# EAGLE design Design (EAGLE 9.6.2)
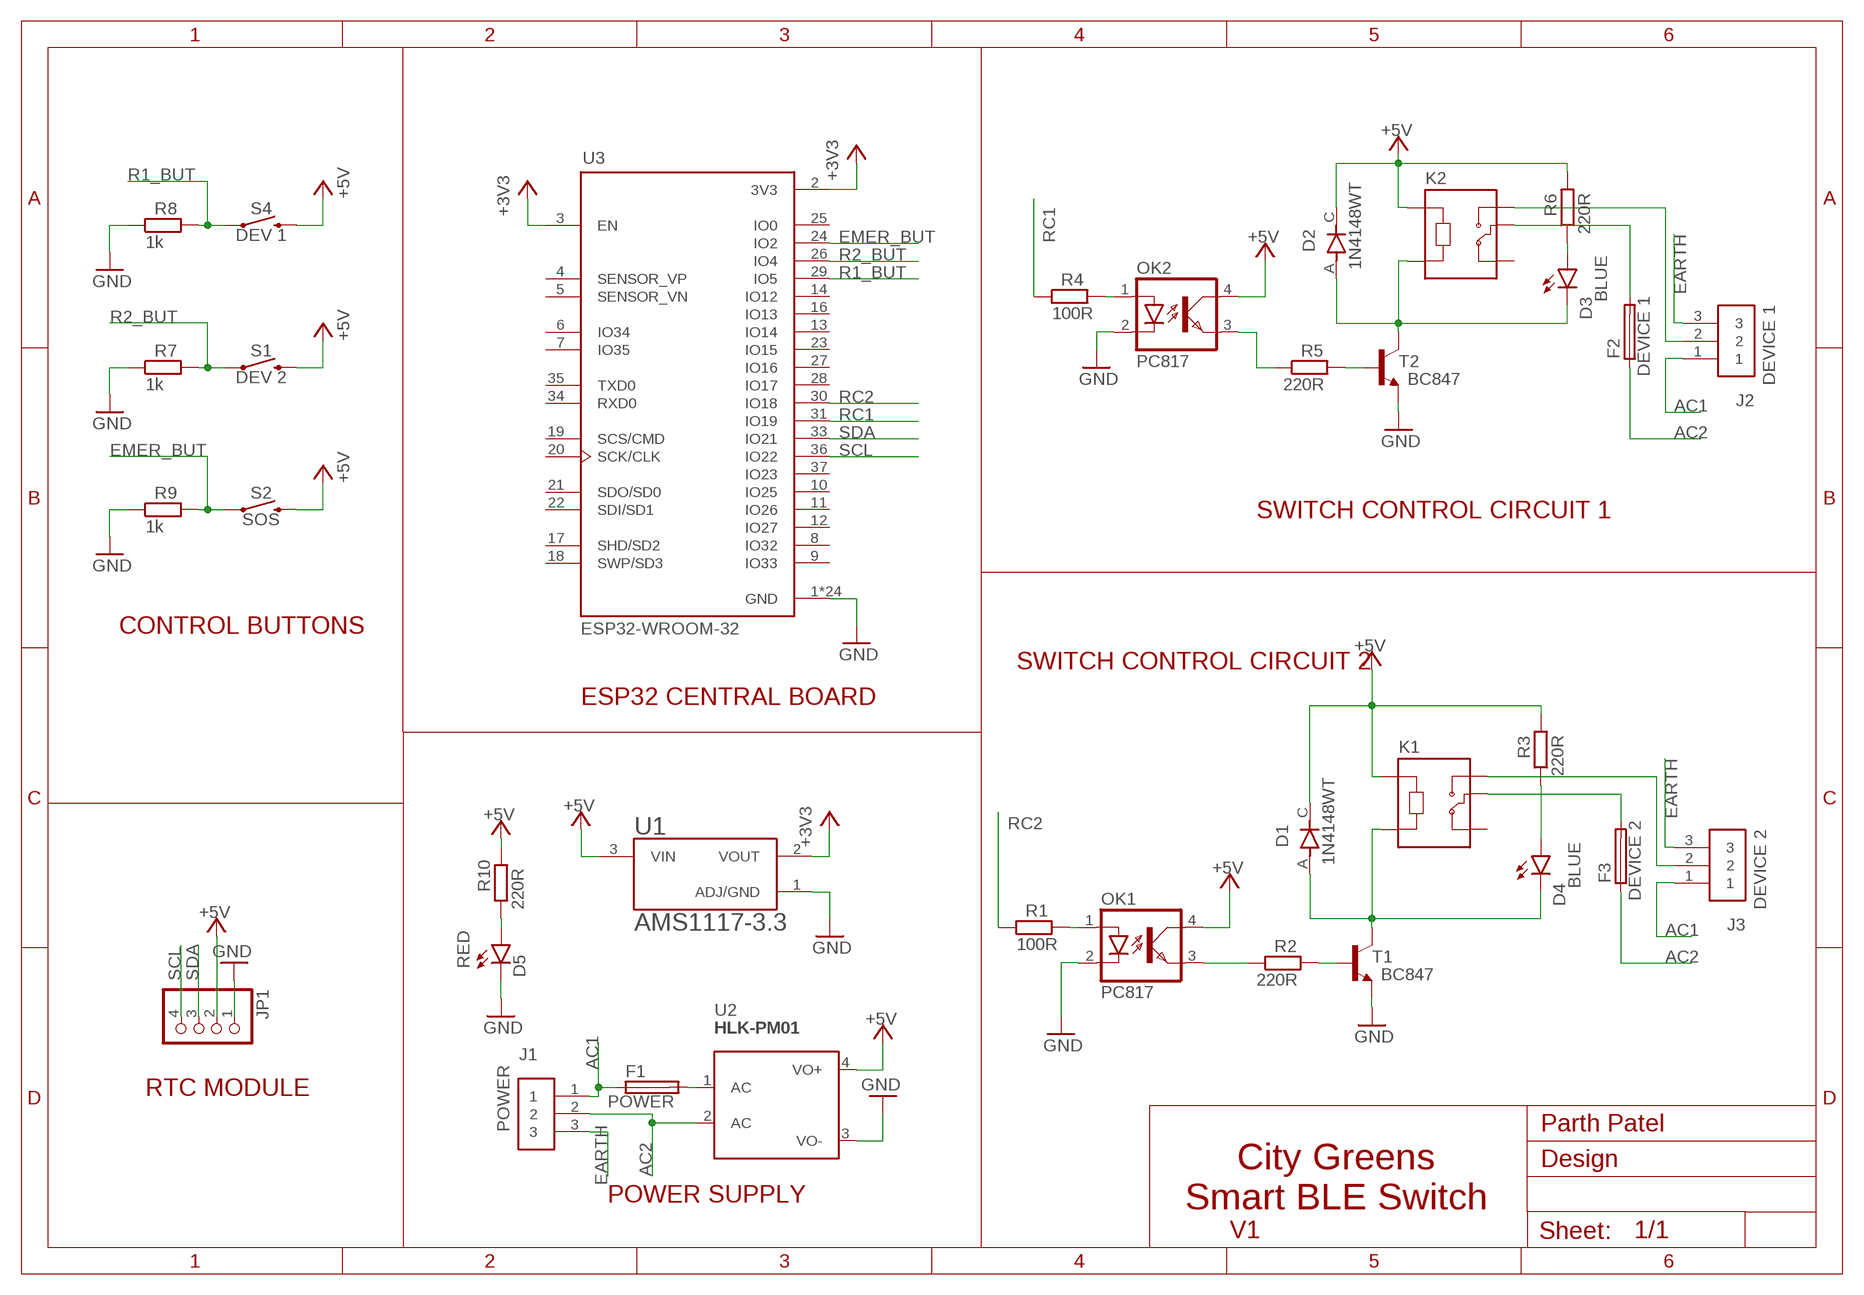
[diagram p0: schematic, sheet 1]

## Parts
D1  1N4148WT  [SODFL1608X70N]
D2  1N4148WT  [SODFL1608X70N]
D3  BLUE  LEDCHIP-LED0603  [CHIP-LED0603]
D4  BLUE  LEDCHIP-LED0603  [CHIP-LED0603]
D5  RED  LEDCHIP-LED0603  [CHIP-LED0603]
F1  POWER  TE5  [TE5]
F2  DEVICE 1  TE5  [TE5]
F3  DEVICE 2  TE5  [TE5]
J1  POWER  691311400103  [TERMINALBLOCK_PLUGGABLE-3-7.62MM]
J2  DEVICE 1  691311400103  [TERMINALBLOCK_PLUGGABLE-3-7.62MM]
J3  DEVICE 2  691311400103  [TERMINALBLOCK_PLUGGABLE-3-7.62MM]
JP1  PINHD-1X4  [1X04]
K1  SRD-05VDC-SL-C  [RELAY_SRD-05VDC-SL-C]
K2  SRD-05VDC-SL-C  [RELAY_SRD-05VDC-SL-C]
OK1  PC817  [DIL04]
OK2  PC817  [DIL04]
R1  100R  R-EU_R0805  [R0805]
R2  220R  R-EU_R0805  [R0805]
R3  220R  R-EU_R0805  [R0805]
R4  100R  R-EU_R0805  [R0805]
R5  220R  R-EU_R0805  [R0805]
R6  220R  R-EU_R0805  [R0805]
R7  1k  R-EU_R0805  [R0805]
R8  1k  R-EU_R0805  [R0805]
R9  1k  R-EU_R0805  [R0805]
R10  220R  R-EU_R0805  [R0805]
S1  DEV 2  MOMENTARY-SWITCH-SPST-SMD-4.5MM  [TACTILE_SWITCH_SMD_4.5MM]
S2  SOS  MOMENTARY-SWITCH-SPST-SMD-4.5MM  [TACTILE_SWITCH_SMD_4.5MM]
S4  DEV 1  MOMENTARY-SWITCH-SPST-SMD-4.5MM  [TACTILE_SWITCH_SMD_4.5MM]
T1  BC847  [SOT23]
T2  BC847  [SOT23]
U1  AMS1117-3.3  [SOT229P700X180-4N]
U2  HLK-PM01  [HLK-PM01]
U3  ESP32-WROOM-32  [MODULE_ESP32-WROOM-32]

## Nets
+3V3: U1.2(VOUT) U3.2(3V3) U3.3(EN)
+5V: D1.C D2.C JP1.2 K1.A1 K2.A1 OK1.4(COL) OK2.4(COL) R3.2 R6.2 R10.2 S1.1 S1.4 S2.1 S2.4 S4.1 S4.4 U1.3(VIN) U2.4(VO+)
AC1: F1.1 J1.1 J2.1 J3.1
AC2: F2.1 F3.1 J1.2 U2.2(AC)
EARTH: J1.3 J2.3 J3.3
EMER_BUT: R9.2 S2.2 S2.3 U3.24(IO2)
GND: D5.C JP1.1 OK1.2(C) OK2.2(C) R7.1 R8.1 R9.1 T1.2(E) T2.2(E) U1.1(ADJ/GND) U2.3(VO-) U3.1(GND) U3.15(GND) U3.38(GND) U3.39_1(GND) U3.39_2(GND) U3.39_3(GND) U3.39_4(GND) U3.39_5(GND) U3.39_6(GND) U3.39_7(GND) U3.39_8(GND) U3.39_9(GND) U3.39_10(GND) U3.39_11(GND) U3.39_12(GND) U3.39_13(GND) U3.39_14(GND) U3.39_15(GND) U3.39_16(GND) U3.39_17(GND) U3.39_18(GND) U3.39_19(GND) U3.39_20(GND) U3.39_21(GND)
N$1: F1.2 U2.1(AC)
N$2: OK1.3(EMIT) R2.1
N$3: OK1.1(A) R1.2
N$4: R2.2 T1.1(B)
N$6: D1.A D4.C K1.A2 T1.3(C)
N$7: D4.A R3.1
N$8: J3.2 K1.NO
N$9: OK2.1(A) R4.2
N$10: OK2.3(EMIT) R5.1
N$11: R5.2 T2.1(B)
N$12: D2.A D3.C K2.A2 T2.3(C)
N$13: D3.A R6.1
N$14: F2.2 K2.COM
N$15: J2.2 K2.NO
N$16: F3.2 K1.COM
N$17: D5.A R10.1
R1_BUT: R8.2 S4.2 S4.3 U3.29(IO5)
R2_BUT: R7.2 S1.2 S1.3 U3.26(IO4)
RC1: R4.1 U3.31(IO19)
RC2: R1.1 U3.30(IO18)
SCL: JP1.4 U3.36(IO22)
SDA: JP1.3 U3.33(IO21)
Unconnected: K1.NC K2.NC U3.4(SENSOR_VP) U3.5(SENSOR_VN) U3.6(IO34) U3.7(IO35) U3.8(IO32) U3.9(IO33) U3.10(IO25) U3.11(IO26) U3.12(IO27) U3.13(IO14) U3.14(IO12) U3.16(IO13) U3.17(SHD/SD2) U3.18(SWP/SD3) U3.19(SCS/CMD) U3.20(SCK/CLK) U3.21(SDO/SD0) U3.22(SDI/SD1) U3.23(IO15) U3.25(IO0) U3.27(IO16) U3.28(IO17) U3.34(RXD0) U3.35(TXD0) U3.37(IO23)

## Notes on the sheet
- SWITCH CONTROL CIRCUIT 1
- CONTROL BUTTONS
- SWITCH CONTROL CIRCUIT 2
- ESP32 CENTRAL BOARD
- RTC MODULE
- Parth Patel
- City Greens
  Smart BLE Switch
- POWER SUPPLY
- V1

## Library data of the parts
D1 = 1N4148WT:1N4148WT: Diode Switching 100V 0.125A 2-Pin SOD-523 Check availability <https://pricing.snapeda.com/parts/1N4148WT/ON%20Semiconductor/view-part?ref=eda>; AVAILABILITY: In Stock; DESCRIPTION: 1N4148WT Series 75 V 300 mA High Conductance Fast Switching Diode - SOD-523F; MF: ON Semiconductor; MP: 1N4148WT; PACKAGE: SOD-523-2 ON Semiconductor; PRICE: None; PURCHASE-URL: https://pricing.snapeda.com/search/part/1N4148WT/?ref=eda
D2 = 1N4148WT:1N4148WT: Diode Switching 100V 0.125A 2-Pin SOD-523 Check availability <https://pricing.snapeda.com/parts/1N4148WT/ON%20Semiconductor/view-part?ref=eda>; AVAILABILITY: In Stock; DESCRIPTION: 1N4148WT Series 75 V 300 mA High Conductance Fast Switching Diode - SOD-523F; MF: ON Semiconductor; MP: 1N4148WT; PACKAGE: SOD-523-2 ON Semiconductor; PRICE: None; PURCHASE-URL: https://pricing.snapeda.com/search/part/1N4148WT/?ref=eda; SPICEPREFIX: D
D3-D5 = led:LED: LED OSRAM: - CHIPLED LG R971, LG N971, LY N971, LG Q971, LY Q971, LO R971, LY R971 LH N974, LH R974 LS Q976, LO Q976, LY Q976 LO Q996 - Hyper CHIPLED LW Q18S LB Q993, LB Q99A, LB R99A - SideLED LS A670, LO A670, LY A670, LG A670, LP A670 LB A673, LV A673, LT A673, LW A673 LH A674 LY A675 LS A676, LA A676, LO A676, LY A676, LW A676 LS A679, LY A679, LG A679 - Hyper Micro SIDELED® LS Y876, LA Y876, LO Y876, LY Y876 LT Y87S - SmartLED LW L88C, LW L88S LB L89C, LB L89S, LG L890 LS L89K, LO L89K, LY L89K LS L896, LA L896, LO L896, LY L896 - TOPLED LS T670, LO T670, LY T670, LG T670, LP T670 LSG T670, LSP T670, LSY T670, LOP T670, LYG T670 LG T671, LOG T671, LSG T671 LB T673, LV T673, LT T673, LW T673 LH T674 LS T676, LA T676, LO T676, LY T676, LB T676, LH T676, LSB T676, LW T676 LB T67C, LV T67C, LT T67C, LS T67K, LO T67K, LY T67K, LW E67C LS E67B, LA E67B, LO E67B, LY E67B, LB E67C, LV E67C, LT E67C LW T67C LS T679, LY T679, LG T679 LS T770, LO T770, LY T770, LG T770, LP T770 LB T773, LV T773, LT T773, LW T773 LH T774 LS E675, LA E675, LY E675, LS T675 LS T776, LA T776, LO T776, LY T776, LB T776 LHGB T686 LT T68C, LB T68C - Hyper Mini TOPLED® LB M676 - Mini TOPLED Santana® LG M470 LS M47K, LO M47K, LY M47K Source: http://www.osram.convergy.de LUXEON: - LUMILED® LXK2-PW12-R00, LXK2-PW12-S00, LXK2-PW14-U00, LXK2-PW14-V00 LXK2-PM12-R00, LXK2-PM12-S00, LXK2-PM14-U00 LXK2-PE12-Q00, LXK2-PE12-R00, LXK2-PE12-S00, LXK2-PE14-T00, LXK2-PE14-U00 LXK2-PB12-K00, LXK2-PB12-L00, LXK2-PB12-M00, LXK2-PB14-N00, LXK2-PB14-P00, LXK2-PB14-Q00 LXK2-PR12-L00, LXK2-PR12-M00, LXK2-PR14-Q00, LXK2-PR14-R00 LXK2-PD12-Q00, LXK2-PD12-R00, LXK2-PD12-S00 LXK2-PH12-R00, LXK2-PH12-S00 LXK2-PL12-P00, LXK2-PL12-Q00, LXK2-PL12-R00 Source: www.luxeon.com KINGBRIGHT: KA-3528ASYC Source: www.kingbright.com
F1-F3 = fuse:TE5: FUSE Wickmann; OC_FARNELL: unknown; OC_NEWARK: unknown
J1-J3 = Terminal Blocks:691311400103: 7.62MM CLOSE VERTICAL PCB HEADER WR-TBL Manufacturer's datasheet <https://katalog.we-online.com/em/datasheet/6913114001xx.pdf>; CREATED_BY: PCBLayout.com; DIGIKEY_PART_NO: 732-2824-ND; MANUFACTURER: WURTH ELEKTRONIK; MPN: 691311400103
JP1 = pinhead:PINHD-1X4: PIN HEADER
K1 K2 = SRD-05VDC-SL-C:SRD-05VDC-SL-C: 5V Trigger Relay Module For Arduino And Raspberry Pi 5V Trigger Relay Module For Arduino And Raspberry Pi Check availability <https://pricing.snapeda.com/parts/SRD-05VDC-SL-C/Songle%20Relay/view-part?ref=eda>; AVAILABILITY: In Stock; DESCRIPTION: 5V Trigger Relay Module For Arduino And Raspberry Pi 5V Trigger Relay Module For Arduino And Raspberry Pi; MF: Songle Relay; MP: SRD-05VDC-SL-C; PACKAGE: None; PRICE: None
OK1 OK2 = optocoupler:PC817: SHARP OPTO COUPLER; MPN: PC817X4J000F; OC_FARNELL: 9707727; OC_NEWARK: 97K7059
R1-R10 = rcl:R-EU_: RESISTOR, European symbol; SPICEPREFIX: R
S1 S2 S4 = SparkFun-Switches:MOMENTARY-SWITCH-SPST: Momentary Switch (Pushbutton) - SPST Normally-open (NO) SPST momentary switches (buttons, pushbuttons). Variants PTH-12MM - 12mm square, through-hole Momentary Pushbutton Switch - 12mm Square <https://www.sparkfun.com/products/9190> (COM-09190) PTH-6.0MM, PTH-6.0MM-KIT - 6.0mm square, through-hole Mini Pushbutton Switch <https://www.sparkfun.com/products/97> (COM-00097) KIT package intended for soldering kit's - only one side of pads' copper is exposed. PTH-RIGHT-ANGLE-KIT - Right-angle, through-hole Right Angle Tactile Button <https://www.sparkfun.com/products/10791> - Used on SparkFun BigTime Watch Kit <https://www.sparkfun.com/products/11734> SMD-12MM - 12mm square, surface-mount Tactile Button - SMD (12mm) <https://www.sparkfun.com/products/12993> (COM-12993) Used on SparkFun PicoBoard <https://www.sparkfun.com/products/11888> SMD-4.5MM - 4.5mm Square Trackball Switch Used on SparkFun Blackberry Trackballer Breakout <https://www.sparkfun.com/products/13169> SMD-4.6MMX2.8MM - 4.60mm x 2.80mm, surface mount Used on SparkFun SAMD21 Mini Breakout <https://www.sparkfun.com/products/13664> SMD-5.2MM, SMD-5.2-REDUNDANT - 5.2mm square, surface-mount Mini Pushbutton Switch - SMD <https://www.sparkfun.com/products/8720> (COM-08720) Used on Arduino Pro Mini <https://www.sparkfun.com/products/11114> REDUNDANT package connects both switch circuits together SMD-6.0X3.5MM - 6.0 x 3.5mm, surface mount Momentary Reset Switch SMD <https://www.sparkfun.com/products/8229> (COM-08229) SMD-6.2MM-TALL - 6.2mm square, surface mount Tactile Button - SMD (6mm) <https://www.sparkfun.com/products/12992> Used on SparkFun Digital Sandbox <https://www.sparkfun.com/products/12651> SMD-RIGHT-ANGLE - Right-angle, surface mount Used on SparkFun Block for Intel® Edison - Arduino <https://www.sparkfun.com/products/13036>; PROD_ID: SWCH-09213
T1 T2 = transistor:BC847: NPN TRANSISTOR
U1 = AMS1117-3.3:AMS1117-3.3: Sot223/Pkg 1-Amp 3.3-Volt Low Drop Out Voltage Regulatator Check availability <https://pricing.snapeda.com/parts/AMS1117-3.3/AMD/view-part?ref=eda>; AVAILABILITY: In Stock; DESCRIPTION: LDO Voltage Regulators 800MA LDO LINEAR REG; MF: AMD; MP: AMS1117-3.3; PACKAGE: None; PRICE: None
U2 = Hi-Link AC to DC Power Supply:HLK-PM01: Check prices <https://pricing.snapeda.com/parts/hlk-pm01/Hi-link/view-part?ref=eda>; AVAILABILITY: Not in stock; DESCRIPTION: The 3W ultra-small series module power supply is a small-volume, high-efficiency AC DC power module supply designed by Shenzhen Hi-Link Electronics Co.,Ltd. It has the advantages of global input voltage range, low temperature rise, low power consumption,high efficiency, high reliability and high safety isolation. It has been widely used in smart home, automation control, communications equipment, instrumentation and other industries.; MF: Hi-link; MP: hlk-pm01; PACKAGE: None; PRICE: None
U3 = ESP32 WROOM 32:ESP32-WROOM-32: Bluetooth, WiFi Transceiver Module 2.4GHz ~ 2.5GHz Surface Mount Check availability <https://pricing.snapeda.com/parts/ESP32-WROOM-32/Espressif%20Systems/view-part?ref=eda>; AVAILABILITY: In Stock; DESCRIPTION: Bluetooth, WiFi 802.11b/g/n, Bluetooth v4.2 +EDR, Class 1, 2 and 3 Transceiver Module 2.4GHz ~ 2.5GHz Antenna Not Included, U.FL Surface Mount; MF: Espressif Systems; MP: ESP32-WROOM-32; PACKAGE: Module Espressif Systems; PRICE: None; PURCHASE-URL: https://pricing.snapeda.com/search/part/ESP32-WROOM-32/?ref=eda

## Board
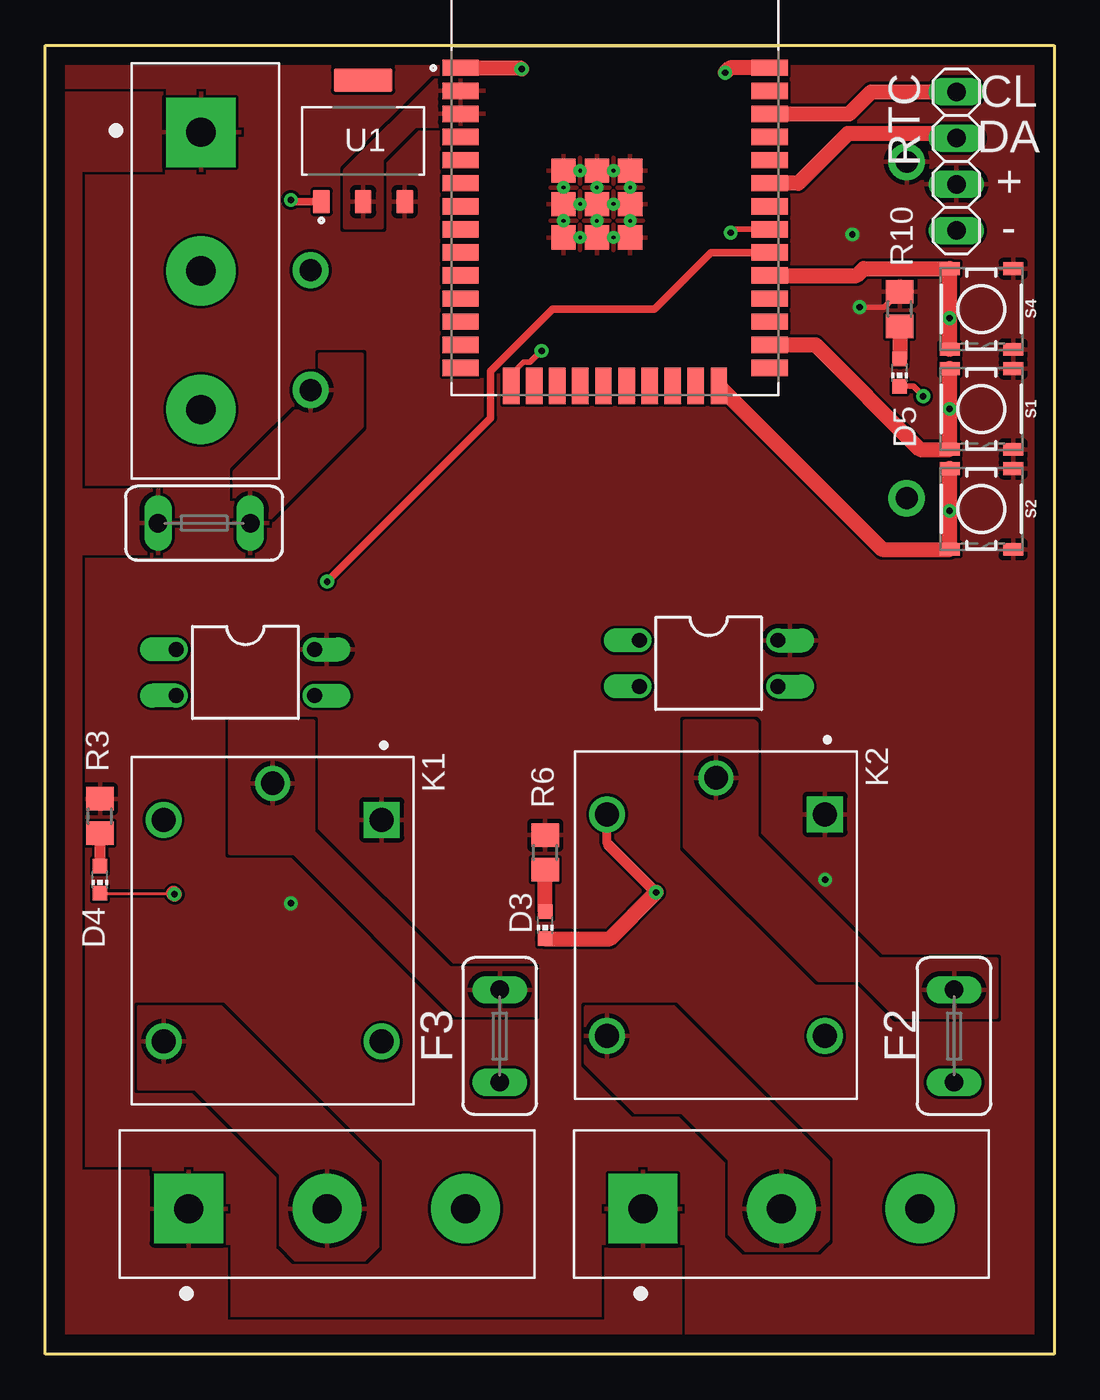
[diagram p1: board, top side]
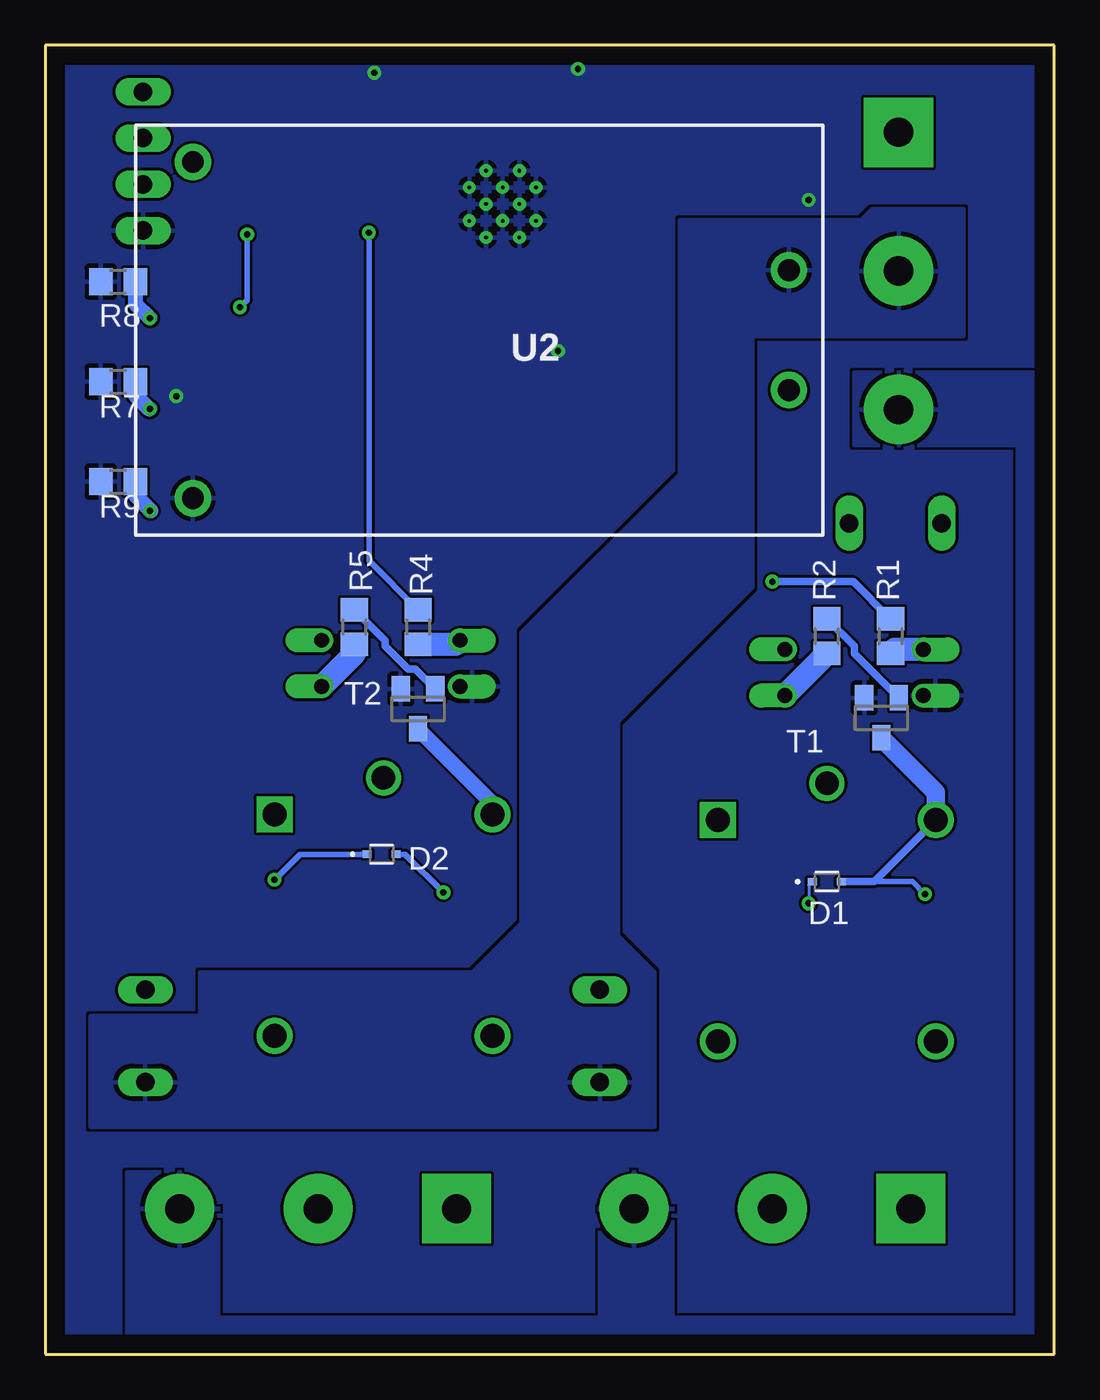
[diagram p2: board, bottom side, seen from below]

Size 55.5 x 72 mm. Coordinates in mm from the lower left corner, seen from the top.
Outline: 55.5,72 55.5,0 0,0 0,72 55.5,72
Copper layers (1*16): Top 0.035mm / dielectric 1.5mm / Bottom 0.035mm
Design rules "default": minimum track width 6mil, minimum drill 0.35mm, track to track 6mil, track to pad 6mil, pad to pad 6mil, via to via 6mil, smd to smd 6mil, copper to edge 40mil, drill to drill 6mil, minimum pad ring 10mil, minimum via ring 8mil, stop-mask expansion 4mil, vias tented up to drill 0mil, thermal gap 10mil

### Footprints (pad centres in the part's own frame; a part is rotated, then mirrored left to right if it is on the bottom)
SODFL1608X70N = smd 0.53 x 0.4: A 0.8,0; C -0.8,0
CHIP-LED0603 = smd 0.8 x 0.8: A 0,-0.75; C 0,0.75
TE5 = drill 1.016 long: 1 -2.54,0; 2 2.54,0
TERMINALBLOCK_PLUGGABLE-3-7.62MM = drill 1.6 pad 3.81 square: 1 -7.62,0 | drill 1.6 pad 3.81: 2 0,0; 3 7.62,0
1X04 = drill 1.016 long: 1 -3.81,0; 2 -1.27,0; 3 1.27,0; 4 3.81,0
RELAY_SRD-05VDC-SL-C = drill 1.32 square: A1 -6.1,6 | drill 1.32: A2 -6.1,-6; NC 6.1,6; NO 6.1,-6 | drill 1.29: COM -8.1,0
DIL04 = drill 0.813 offset: 1 -1.27,-3.81; 2 1.27,-3.81; 3 1.27,3.81; 4 -1.27,3.81
R0805 = smd 1.3 x 1.5: 1 -0.95,0; 2 0.95,0
TACTILE_SWITCH_SMD_4.5MM = smd 0.7 x 1.1: 1 2.225,1.75; 2 2.225,-1.75; 3 -2.225,-1.75; 4 -2.225,1.75
SOT23 = smd 1 x 1.4: 1 -0.95,-1.1; 2 0.95,-1.1; 3 0,1.1
SOT229P700X180-4N = smd 0.93 x 1.31: 1 -2.29,-3.345; 2 0,-3.345; 3 2.29,-3.345 | smd 3.24 x 1.31: 4 0,3.345
HLK-PM01 = drill 1.2 pad 2: 1 -16.4,3.3; 2 -16.4,-3.3; 3 16.4,9.25; 4 16.4,-9.25
MODULE_ESP32-WROOM-32 = smd 2 x 0.9: 1 -8.5,5.26; 2 -8.5,3.99; 3 -8.5,2.72; 4 -8.5,1.45; 5 -8.5,0.18; 6 -8.5,-1.09; 7 -8.5,-2.36; 8 -8.5,-3.63; 9 -8.5,-4.9; 10 -8.5,-6.17; 11 -8.5,-7.44; 12 -8.5,-8.71; 13 -8.5,-9.98; 14 -8.5,-11.25; 25 8.5,-11.25; 26 8.5,-9.98; 27 8.5,-8.71; 28 8.5,-7.44; 29 8.5,-6.17; 30 8.5,-4.9; 31 8.5,-3.63; 32 8.5,-2.36; 33 8.5,-1.09; 34 8.5,0.18; 35 8.5,1.45; 36 8.5,2.72; 37 8.5,3.99; 38 8.5,5.26 | smd 0.9 x 2: 15 -5.715,-12.25; 16 -4.445,-12.25; 17 -3.175,-12.25; 18 -1.905,-12.25; 19 -0.635,-12.25; 20 0.635,-12.25; 21 1.905,-12.25; 22 3.175,-12.25; 23 4.445,-12.25; 24 5.715,-12.25 | smd 1.33 x 1.33: 39_1 -2.835,-0.405; 39_2 -1,-0.405; 39_3 0.835,-0.405; 39_4 -2.835,-2.24; 39_5 -1,-2.24; 39_6 0.835,-2.24; 39_7 -2.835,-4.075; 39_8 -1,-4.075; 39_9 0.835,-4.075 | drill 0.2 pad 0.3: 39_10 -1.917,-0.405; 39_11 -0.083,-0.405; 39_12 -2.835,-1.323; 39_13 -1,-1.323; 39_14 0.835,-1.323; 39_15 -1.917,-2.24; 39_16 -0.083,-2.24; 39_17 -2.835,-3.158; 39_18 -1,-3.158; 39_19 0.835,-3.158; 39_20 -1.917,-4.075; 39_21 -0.083,-4.075

### Placement (x,y rotation side)
D1  12.5,26 0 bottom
D2  37,27.5 0 bottom
D3  27.5,23.6 180 top
D4  3,26.1 180 top
D5  47,54 180 top
F1  8.73,45.72 0 top
F2  50,17.5 90 top
F3  25,17.5 90 top
J1  8.55,59.59 270 top
J2  40.5,8 0 top
J3  15.5,8 0 top
JP1  50.12,65.63 90 top
K1  12.5,23.3 270 top
K2  36.9,23.6 270 top
OK1  11,37.5 270 top
OK2  36.5,38 270 top
R1  9,39.5 270 bottom
R2  12.5,39.5 90 bottom
R3  3,29.6 90 top
R4  35,40 270 bottom
R5  38.5,40 90 bottom
R6  27.5,27.6 90 top
R7  51.5,53.5 0 bottom
R8  51.5,59 0 bottom
R9  51.5,48 0 bottom
R10  47,57.5 90 top
S1  51.5,52 270 top
S2  51.5,46.5 270 top
S4  51.5,57.5 270 top
T1  9.5,35 180 bottom
T2  35,35.5 180 bottom
U1  17.48,66.75 0 top
U2  30.99,56.34 180 bottom
U3  31.34,65.51 0 top

### Tracks (layer width: path | path; a pad name or v marks a point on that pad's centre or on a via)
+3V3
  pour Top: 16.5,62 18.5,62 18.5,65.75 20.34,67.58 24.11,67.58 24.11,70.12 21.51,70.12 16.5,65.11
+5V  (via drill 0.35)
  Top 0.305: R10.2 46.15,57.6 v44.8,57.6
  Bottom 0.152: D1.C 13.5,25.8 v13.5,24.8
  Bottom 0.305: v44.8,57.6 44.4,58 v44.4,61.6 | D2.C 41.5,27.5 v42.9,26.1
  pour Top (rank 6): -1,-1 56.5,-1 56.5,73 -1,73
AC1
  pour Top: -1.52,69.34 10.67,69.34 10.67,65.15 1.91,65.15 1.91,10.03 9.91,10.03 9.91,1.78 30.86,1.78 30.86,10.03 34.92,10.03 34.92,0 -1.52,0
  pour Top: -1.52,47.5 7.24,47.5 7.24,44.07 -1.52,44.07
AC2
  pour Bottom: 22,12.5 53,12.5 53,18.6 47,18.6 47,21 32,21 29.3,23.7 29.3,39.7 20.6,48.4 20.6,62.4 10.6,62.4 10,63 5,63 5,56 16.6,56 16.6,42.2 24,34.8 24,23 22,21
EARTH
  pour Bottom: 11,54 -2,54 -2,-2 51,-2 51,10 46,10 46,2 25,2 25,10 21,10 21,2 2,2 2,50 11,50
EMER_BUT  (via drill 0.35)
  Top 0.813: S2.3 v49.75,46.4 S2.2 46.04,44.27 U3.24
  Bottom 0.813: R9.2 50.55,47.25 49.7,46.4 v49.75,46.4
GND  (via drill 0.35)
  Top 0.305: v27.3,55.2 26.66,54.56 26.32,54.56 25.62,53.87 U3.15 | D5.C 47.75,53.25 v48.3,52.7
  Top 0.406: U1.1 13.6,63.4 v13.5,63.5
  Top 0.813: U3.1 26.13,70.77 v26.2,70.7 | U3.38 37.67,70.77 v37.4,70.5
  pour Bottom (rank 6): -0.5,72.5 -0.5,-0.5 56,-0.5 56,72.5
  pour Top: 27.69,65.91 27.69,60.58 33.02,60.58 33.02,65.91
N$1
  pour Top: 10.41,44.07 12.19,44.07 12.19,45.85 17.4,51.05 17.4,54.99 15.11,54.99 15.11,53.21 10.41,48.51 10.41,44.83
N$2
  Bottom 1.27: R2.1 OK1.3
N$3
  Bottom 1.27: OK1.1 8.78,38.77 R1.2
N$4
  Bottom 0.406: R2.2 11,38.95 11,38.55 T1.1
N$6  (via drill 0.35)
  Top 0.152: D4.C 7.05,25.35
  Top 0.813: v7.1,25.3 7.05,25.35
  Bottom 0.305: 11.3,26 7.8,26 v7.1,25.3
  Bottom 0.406: D1.A 11.3,26 9.9,26 K1.A2
  Bottom 1.016: T1.3 6.5,30.9 K1.A2
N$7
  Top 0.61: D4.A R3.1
N$8
  pour Top: 5.1,19 5.1,14.6 8.2,14.6 12.7,10.1 12.9,9.9 12.9,6 13.7,5.2 17.4,5.2 17.6,5.2 18.3,5.9 18.3,10.5 9.7,19.1 5.1,19.1
N$9
  Bottom 1.27: OK2.1 32.91,39.05 R4.2
N$10
  Bottom 1.27: OK2.3 38.5,38.54 R5.1
N$11
  Bottom 0.406: T2.1 35.15,37.7 35.55,37.7 36.8,38.95 36.8,39.25 R5.2
N$12  (via drill 0.35)
  Top 0.508: 31.01,27.99 30.9,28.1 K2.A2
  Top 0.61: v33.6,25.4 31.01,27.99
  Top 0.813: v33.6,25.4 31.05,22.85 D3.C
  Bottom 0.305: v33.6,25.4 35.7,27.5 D2.A
  Bottom 0.813: T2.3 30.9,30.3 K2.A2
N$13
  Top 0.813: D3.A R6.1
N$14
  pour Top: 35.18,34.8 35.18,27.94 42.55,20.57 44.83,20.57 46.86,18.54 52.32,18.54 52.32,21.72 45.85,21.72 39.12,28.45 39.12,34.67 38.99,34.8
N$15
  pour Top: 29.7,19.1 29.7,16 30.6,15.1 32.4,13.3 35,13.3 37.6,10.7 37.6,6.6 38.5,5.7 39.1,5.7 42.5,5.7 43,6.2 43.1,6.3 43.1,10.6 34.6,19.1
N$16
  pour Top: 22.61,18.67 26.92,18.67 26.92,21.21 22.23,21.21 14.73,28.7 14.73,34.8 10.16,34.8 10.16,27.56 13.72,27.56
N$17
  Top 0.813: R10.1 D5.A
R1_BUT  (via drill 0.35)
  Top 0.813: S4.2 v49.75,57 S4.3 45.02,59.73 44.64,59.34 U3.29
  Bottom 0.813: R8.2 50.55,57.8 v49.75,57
R2_BUT  (via drill 0.35)
  Top 0.813: S1.3 v49.75,52 S1.2 48.12,49.77 42.37,55.53 U3.26
  Bottom 0.813: R7.2 50.55,52.75 49.8,52 v49.75,52
RC1  (via drill 0.35)
  Top 0.305: U3.31 37.88,61.88 v37.7,61.7
  Bottom 0.305: v37.7,61.7 37.7,43.65 R4.1
RC2  (via drill 0.35)
  Top 0.406: U3.30 36.61,60.61 33.5,57.5 27.91,57.5 24.5,54.09 24.5,51.5 v15.5,42.5
  Bottom 0.406: R1.1 11.05,42.5 v15.5,42.5
SCL
  Top 0.813: U3.36 44.23,68.23 45.44,69.44 JP1.4
SDA
  Top 0.813: U3.33 41.42,64.42 44.15,67.15 49.88,67.15 JP1.3

### Text on the board
tPlace: RTC | CL | DA | + | -